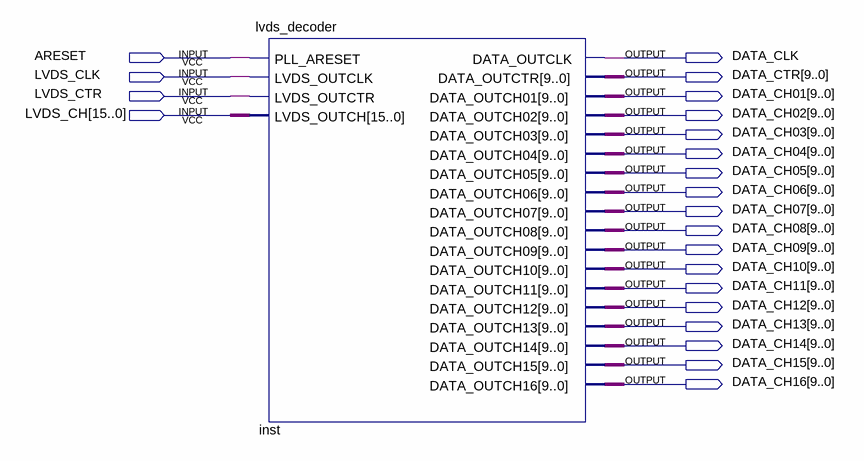
[diagram p0: schematic sheet]
// Quartus schematic tb_lvds_decoder.bdf as structural Verilog: 1 symbols, 22 pins
module tb_lvds_decoder (
  input  ARESET,
  input  LVDS_CLK,
  input  LVDS_CTR,
  input  [15:0] LVDS_CH,
  output DATA_CLK,
  output [9:0] DATA_CTR,
  output [9:0] DATA_CH01,
  output [9:0] DATA_CH02,
  output [9:0] DATA_CH03,
  output [9:0] DATA_CH04,
  output [9:0] DATA_CH05,
  output [9:0] DATA_CH06,
  output [9:0] DATA_CH07,
  output [9:0] DATA_CH08,
  output [9:0] DATA_CH09,
  output [9:0] DATA_CH10,
  output [9:0] DATA_CH11,
  output [9:0] DATA_CH12,
  output [9:0] DATA_CH13,
  output [9:0] DATA_CH14,
  output [9:0] DATA_CH15,
  output [9:0] DATA_CH16
);

  lvds_decoder inst (
    .PLL_ARESET(ARESET), .LVDS_OUTCLK(LVDS_CLK), .LVDS_OUTCTR(LVDS_CTR), .LVDS_OUTCH(LVDS_CH),
    .DATA_OUTCLK(DATA_CLK), .DATA_OUTCTR(DATA_CTR), .DATA_OUTCH01(DATA_CH01), .DATA_OUTCH02(DATA_CH02),
    .DATA_OUTCH03(DATA_CH03), .DATA_OUTCH04(DATA_CH04), .DATA_OUTCH05(DATA_CH05), .DATA_OUTCH06(DATA_CH06),
    .DATA_OUTCH07(DATA_CH07), .DATA_OUTCH08(DATA_CH08), .DATA_OUTCH09(DATA_CH09), .DATA_OUTCH10(DATA_CH10),
    .DATA_OUTCH11(DATA_CH11), .DATA_OUTCH12(DATA_CH12), .DATA_OUTCH13(DATA_CH13), .DATA_OUTCH14(DATA_CH14),
    .DATA_OUTCH15(DATA_CH15), .DATA_OUTCH16(DATA_CH16));
endmodule
